# Altium schematic sheet Sheet3.SchDoc
size A3
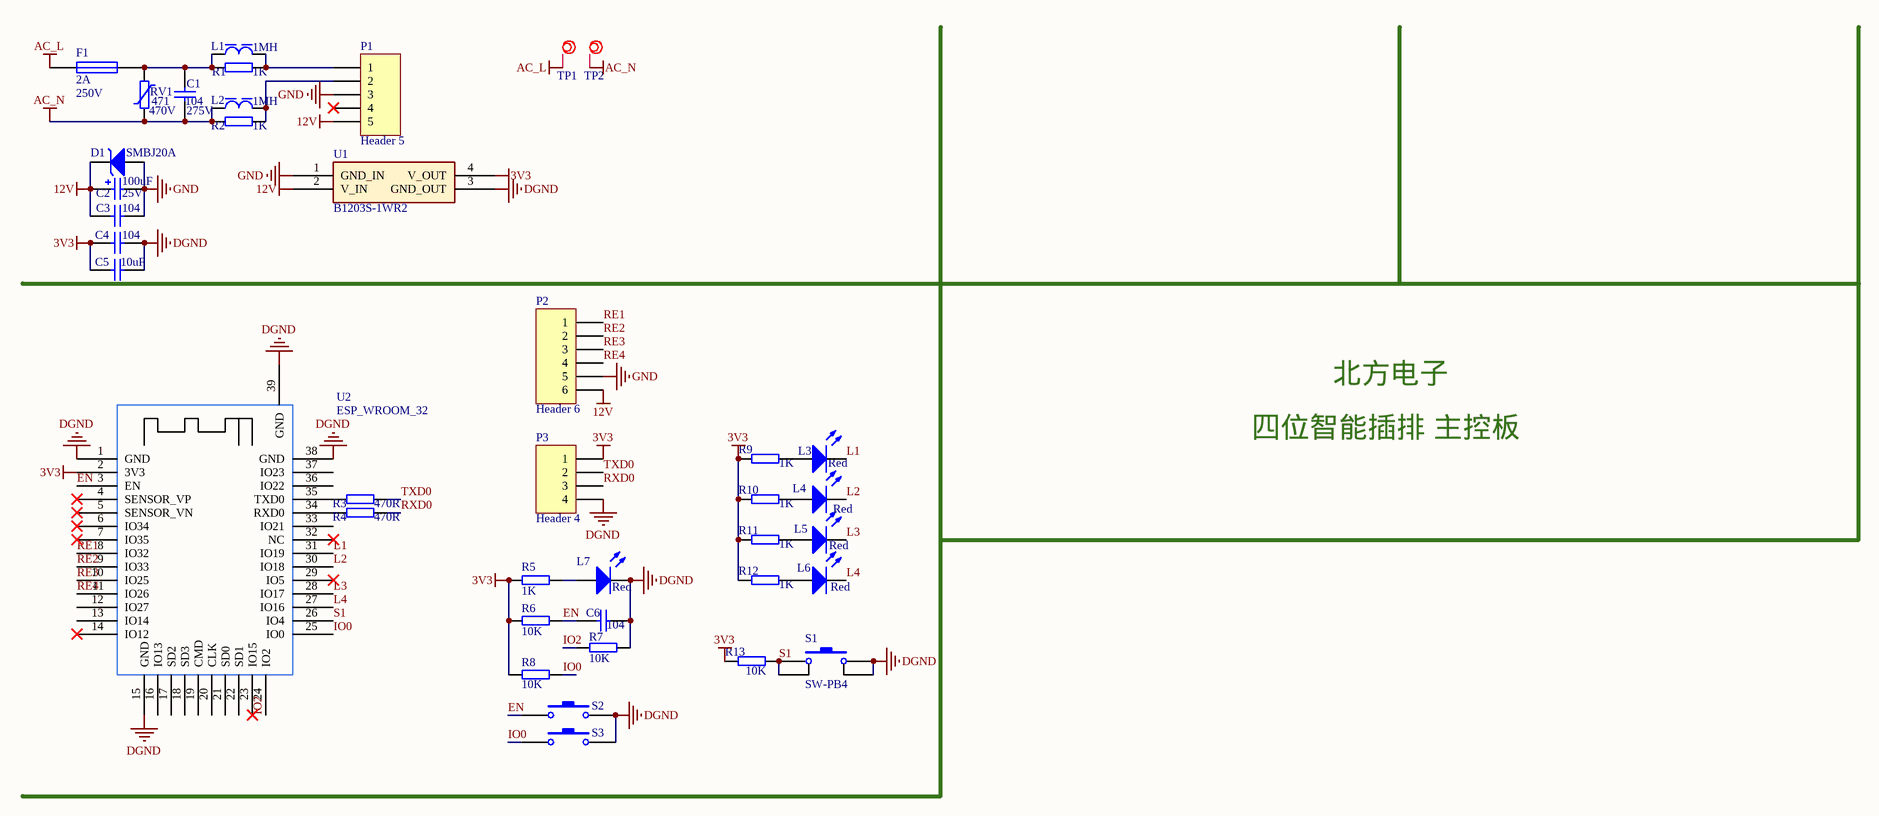
[diagram p0: Sheet3.SchDoc]

## Parts
C1  Voltage: 275V  [MPF131006]  (hidden comment: 104)
C2  Voltage: 25V  [CAPPR2.5-6.3X11.5]  (hidden comment: 100uF)
C3  104  [CAPC1005[0402]S]
C4  104  [CAPC1005[0402]S]
C5  10uF  [CAPC1005[0402]S]
C6  104  [CAPC1005[0402]S]
D1  SMBJ20A  [SMB[DO-214AA]]
F1  Imax: 2A  Voltage: 250V  [FUSE-L]
L1  1MH  [LGA0410]
L2  1MH  [LGA0410]
L3  Red  [LEDC1608(0603)]
L4  Red  [LEDC1608(0603)]
L5  Red  [LEDC1608(0603)]
L6  Red  [LEDC1608(0603)]
L7  Red  [LEDC1608(0603)]
P1  Header 5  [AC-DC 12V 3W]
P2  Header 6  [header 6 1.27mm]
P3  Header 4  [HDR1X4]
R1  1K  [RESC6332[2512]S]
R2  1K  [RESC6332[2512]S]
R3  470R  [RESC1005[0402]S]
R4  470R  [RESC1005[0402]S]
R5  1K  [RESC1005[0402]S]
R6  10K  [RESC1005[0402]S]
R7  10K  [RESC1005[0402]S]
R8  10K  [RESC1005[0402]S]
R9  1K  [RESC1005[0402]S]
R10  1K  [RESC1005[0402]S]
R11  1K  [RESC1005[0402]S]
R12  1K  [RESC1005[0402]S]
R13  10K  [RESC1005[0402]S]
RV1  471  Voltage: 470V  [RESKINK-E75W12]
S1  SW-PB4  [SW_PB4_A1]
S2  SW-PB  [button]  (value not drawn)
S3  SW-PB  [button]  (value not drawn)
TP1  Test Point  [TESTPOINT]  (value not drawn)  (no BOM)
TP2  Test Point  [TESTPOINT]  (value not drawn)  (no BOM)
U1  B1203S-1WR2  [B_S-1WR2]
U2  ESP_WROOM_32  [ESP32]

## Nets
3V3: C4.1 C5.1 P3.1 R5.1 R6.1 R8.1 R9.1 R10.1 R11.1 R12.1 R13.1 U1.4(V_OUT) U2.2(3V3)
12V: C2.1 C3.1 D1.K P1.5 P2.6 U1.2(V_IN)
AC_L: F1.1 TP1.1(TP)
AC_N: C1.1 L2.1 R2.1 RV1.1 TP2.1(TP)
DGND: C4.2 C5.2 C6.1 L7.C P3.4 R7.2 S1.2 S1.3 S2.2 S3.2 U1.3(GND_OUT) U2.1(GND) U2.15(GND) U2.38(GND) U2.39(GND)
GND: C2.2 C3.2 D1.A P1.3 P2.5 U1.1(GND_IN)
EN: C6.2 R6.2 S2.1 U2.3(EN)
IO0: R8.2 S3.1 U2.25(IO0)
IO2: R7.1 U2.24(IO2)
L1: L3.C U2.31(IO19)
L2: L4.C U2.30(IO18)
L3: L5.C U2.28(IO17)
L4: L6.C U2.27(IO16)
RE1: P2.1 U2.8(IO32)
RE2: P2.2 U2.9(IO33)
RE3: P2.3 U2.10(IO25)
RE4: P2.4 U2.11(IO26)
RXD0: P3.3 R4.2
S1: R13.2 S1.1 S1.4 U2.26(IO4)
TXD0: P3.2 R3.2
NetC1_2: C1.2 F1.2 L1.1 R1.1 RV1.2
NetL1_2: L1.2 P1.1 R1.2
NetL2_2: L2.2 P1.2 R2.2
NetL3_A: L3.A R9.2
NetL4_A: L4.A R10.2
NetL5_A: L5.A R11.2
NetL6_A: L6.A R12.2
NetL7_A: L7.A R5.2
NetR3_1: R3.1 U2.35(TXD0)
NetR4_1: R4.1 U2.34(RXD0)

Not connected (* = marked no-connect by the designer): P1 4*; U2 4(SENSOR_VP)* 5(SENSOR_VN)* 6(IO34)* 7(IO35)* 12(IO27) 13(IO14) 14(IO12)* 16(IO13) 17(SD2) 18(SD3) 19(CMD) 20(CLK) 21(SD0) 22(SD1) 23(IO15)* 29(IO5)* 32(NC)* 33(IO21) 36(IO22) 37(IO23)

## Notes on the sheet
- 四位智能插排 主控板
- 北方电子

## Library data of the parts
C1 = Cap Film 275VAC: Film Capacitor; Published: 8-Jun-2000; Revision: July-2002: Re-released for DXP Platform.; Publisher: Altium Limited; Price(RMB): 0.000; Value: 104
C2 = Cap Pol 2.5-6.3: Polarized Capacitor (Radial); Published: 8-Jun-2000; Revision: July-2002: Re-released for DXP Platform.; Publisher: Altium Limited; Price(RMB): 0.000; Value: 100uF
C3-C6 = Cap Chip 2: Chip Capacitor, Silkscreen Border; Voltage: 63V; Tolerance: Y5V; Published: 8-Jun-2000; Revision: July-2002: Re-released for DXP Platform.; Publisher: Altium Limited; Price(RMB): 0.000
  C3 C4 C6: Value: 104
  C5: Value: 10uF
D1 = Diode TVS Uni-Dir: TRANSIENT VOLTAGE  SUPPRESSOR DIODE; Imax: 500mA; Published: 8-Jun-2000; Publisher: Altium Limited; Price(RMB): 0.000; PartNumber: SMBJ20A
F1 = Fuse: Published: 8-Jun-2000; Revision: July-2002: Re-released for DXP Platform.; Publisher: Altium Limited; Price(RMB): 0.000
L1 L2 = Ind Axial: Discrete Inductor, Ferrite-Core; Value: 100uH; Imax: 500mA; DCR: .1m; Revision: July-2002: Re-released for DXP Platform.; Publisher: Altium Limited; Published: 8-Jun-2000; Price(RMB): 0.000
L3-L7 = LED Chip: Typical Chip LED; Published: 8-Jun-2000; Revision: July-2002: Re-released for DXP Platform.; Publisher: Altium Limited; Price(RMB): 0.00; Color: Red
P1 = Header 5: Header, 5-Pin; LatestRevisionDate: 17-Jul-2002; LatestRevisionNote: Re-released for DXP Platform.; Publisher: Altium Limited; Price(RMB): 0.00
P2 = Header 6: Header, 6-Pin; LatestRevisionDate: 17-Jul-2002; LatestRevisionNote: Re-released for DXP Platform.; Publisher: Altium Limited; Price(RMB): 0.00
P3 = Header 4: Header, 4-Pin; LatestRevisionDate: 17-Jul-2002; LatestRevisionNote: Re-released for DXP Platform.; Publisher: Altium Limited; Price(RMB): 0.00
R1-R13 = Res Chip 2p 2: Chip Resistor, Border Silkscreen On PCB Library; Tolerance: 5%; Published: 8-Jun-2000; Revision: July-2002: Re-released for DXP Platform.; Publisher: Altium Limited; Price(RMB): 0.000
  R1 R2 R5 R9-R12: Value: 1K
  R3 R4: Value: 470R
  R6-R8 R13: Value: 10K
RV1 = Res Varistor: Voltage Sense Resistor; Value: 472; Published: 24-Mar-1999; Revision: July-2002: Re-released for DXP Platform.; Publisher: Altium Limited; Price(RMB): 0.000
S1 = SW-PB4: 微动开关; Published: 24-Mar-1999; LatestRevisionDate: 17-Jul-2002; LatestRevisionNote: Re-released for DXP Platform.; PackageReference: SPST-2; Publisher: Altium Limited
S2 S3 = SW-PB: Switch; Published: 24-Mar-1999; Revision: July-2002: Re-released for DXP Platform.; Publisher: Altium Limited; Price(RMB): 0.000
TP1 TP2 = Test Point: Test Point for Manufature; Price(RMB): 0.000
U1 = B_S-1WR2